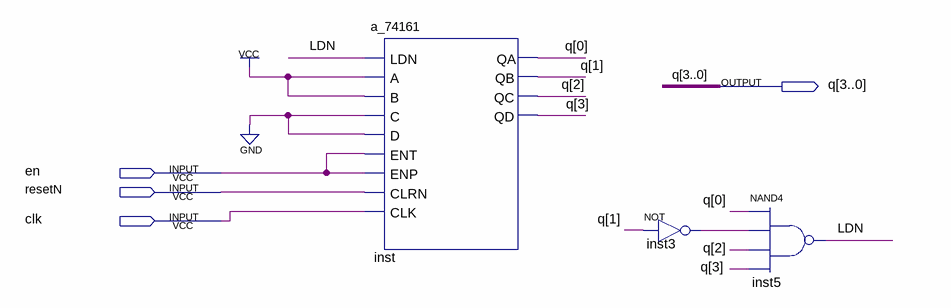
[diagram p0: schematic sheet]
// Quartus schematic counter.bdf as structural Verilog: 3 symbols, 4 pins
module counter (
  input  en,
  input  resetN,
  input  clk,
  output [3:0] q
);

  wire inst3_out, LDN;

  a_74161 inst (
    .LDN(LDN), .A(1'b1), .B(1'b1), .C(1'b0), .D(1'b0), .ENT(en), .ENP(en), .CLRN(resetN), .CLK(clk),
    .QA(q[0]), .QB(q[1]), .QC(q[2]), .QD(q[3]));
  not inst3 (inst3_out, q[1]);
  nand inst5 (LDN, q[0], inst3_out, q[2], q[3]);
endmodule
